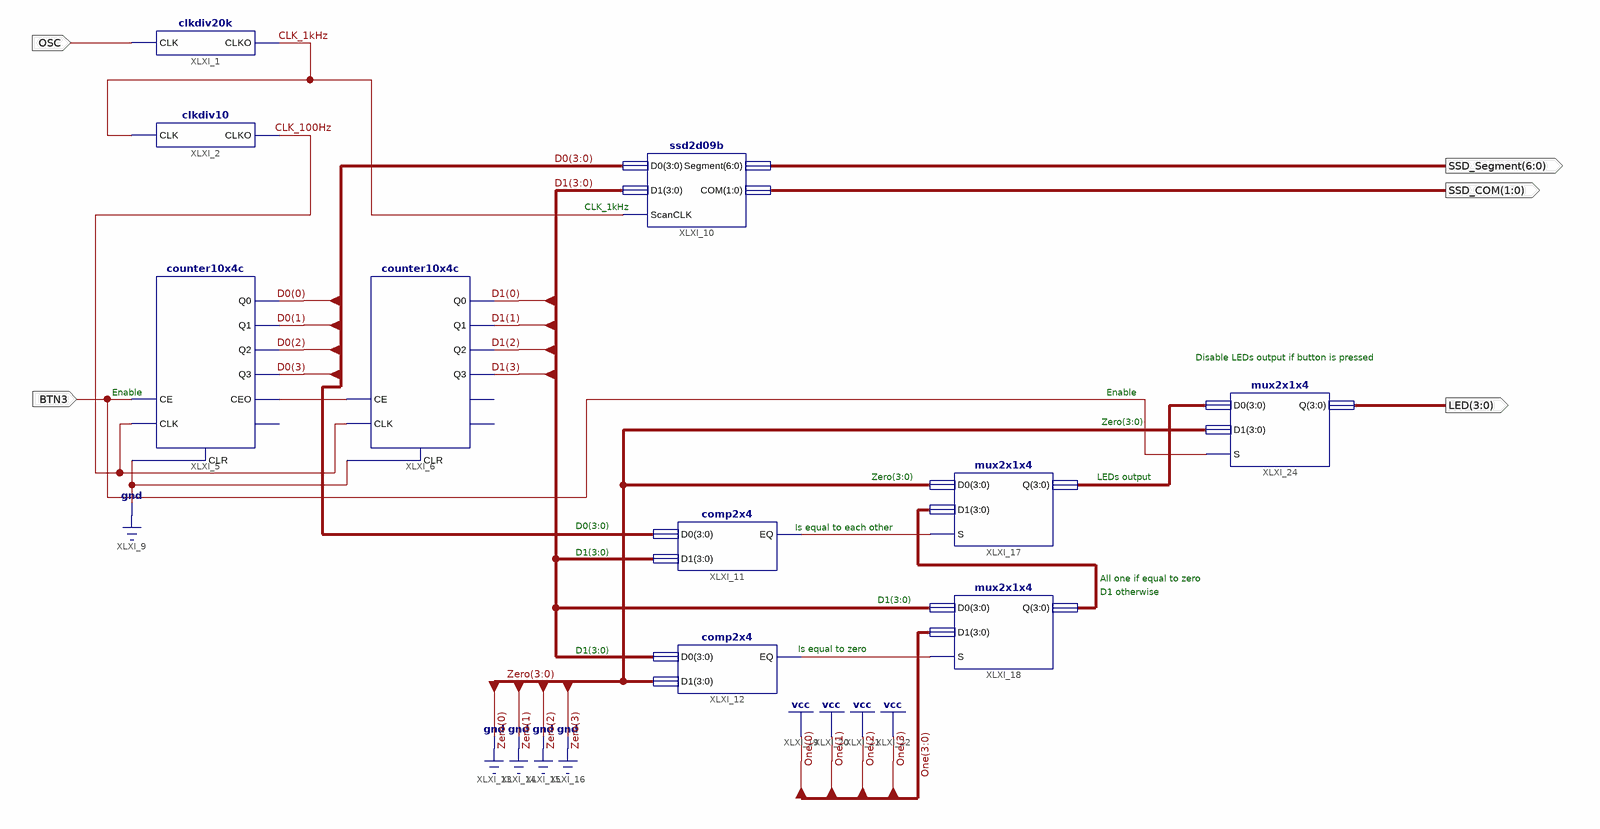
[diagram p0: schematic sheet 1]
// Xilinx ISE schematic main.sch (spartan6) as structural Verilog: 10 symbols, 5 ports
module main (
  input  OSC,
  input  BTN3,
  output [1:0] SSD_COM,
  output [6:0] SSD_Segment,
  output [3:0] LED
);

  wire CLK_1kHz, CLK_100Hz, XLXN_1, XLXN_33, XLXN_34;
  wire [3:0] D0, D1, rLED, XLXN_36;

  clkdiv20k XLXI_1 (.CLK(OSC), .CLKO(CLK_1kHz));
  clkdiv10 XLXI_2 (.CLK(CLK_1kHz), .CLKO(CLK_100Hz));
  counter10x4c XLXI_5 (
    .CEO(XLXN_1), .Q0(D0[0]), .Q1(D0[1]), .Q2(D0[2]), .Q3(D0[3]), .CLR(1'b0), .CE(BTN3), .CLK(CLK_100Hz));  // open: TC
  counter10x4c XLXI_6 (
    .Q0(D1[0]), .Q1(D1[1]), .Q2(D1[2]), .Q3(D1[3]), .CLR(1'b0), .CE(XLXN_1), .CLK(CLK_100Hz));  // open: CEO, TC
  ssd2d09b XLXI_10 (.COM(SSD_COM), .D0(D0), .D1(D1), .ScanCLK(CLK_1kHz), .Segment(SSD_Segment));
  comp2x4 XLXI_11 (.D0(D0), .D1(D1), .EQ(XLXN_33));
  comp2x4 XLXI_12 (.D0(D1), .D1(4'b0000), .EQ(XLXN_34));
  mux2x1x4 XLXI_17 (.D0(4'b0000), .D1(XLXN_36), .Q(rLED), .S(XLXN_33));
  mux2x1x4 XLXI_18 (.D0(D1), .D1(4'b1111), .Q(XLXN_36), .S(XLXN_34));
  mux2x1x4 XLXI_24 (.D0(rLED), .D1(4'b0000), .Q(LED), .S(BTN3));

  // Notes on the sheet:
  //   CLK_1kHz
  //   Disable LEDs output if button is pressed
  //   Enable
  //   Enable
  //   Zero(3:0)
  //   Zero(3:0)
  //   LEDs output
  //   D0(3:0)
  //   Is equal to each other
  //   D1(3:0)
  //   All one if equal to zero
  //   D1 otherwise
  //   D1(3:0)
  //   Is equal to zero
  //   D1(3:0)
endmodule
